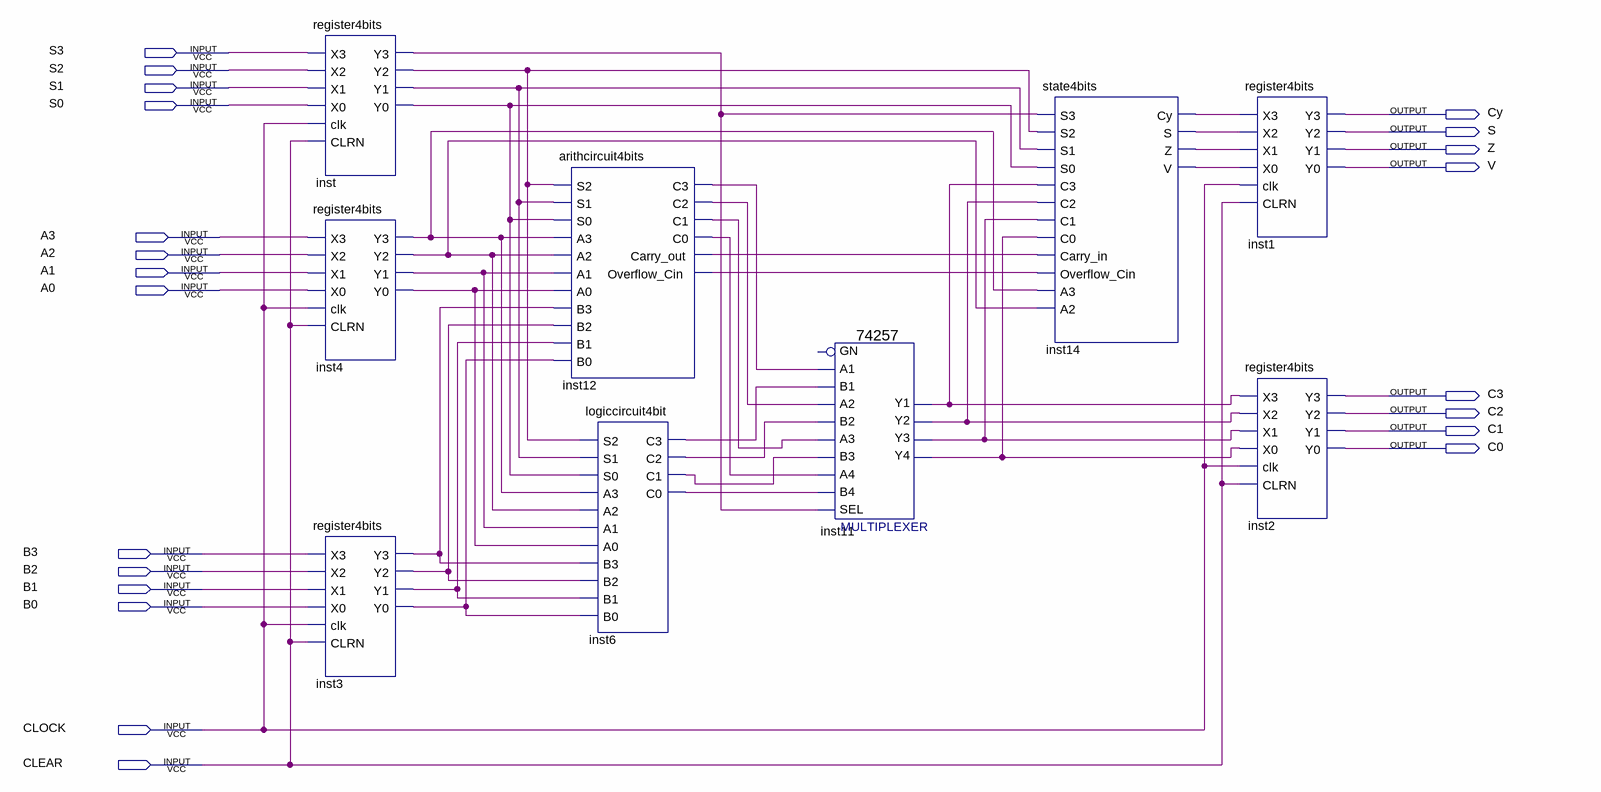
[diagram p0: schematic sheet]
// Quartus schematic lab3top.bdf as structural Verilog: 9 symbols, 22 pins
module lab3top (
  input  S3,
  input  S2,
  input  S1,
  input  S0,
  input  A3,
  input  A2,
  input  A1,
  input  A0,
  input  B3,
  input  B2,
  input  B1,
  input  B0,
  input  CLOCK,
  input  CLEAR,
  output Cy,
  output S,
  output Z,
  output V,
  output C3,
  output C2,
  output C1,
  output C0
);

  wire inst3_y0, inst3_y1, inst3_y2, inst3_y3, inst4_y0, inst4_y1, inst4_y2, inst4_y3, inst6_c0, inst6_c1,
       inst6_c2, inst6_c3, inst11_y1, inst11_y2, inst11_y3, inst11_y4, inst12_c0, inst12_c1, inst12_c2,
       inst12_c3, inst12_carry_out, inst12_overflow_cin, inst14_cy, inst14_s, inst14_v, inst14_z, inst_y0,
       inst_y1, inst_y2, inst_y3;

  register4bits inst (
    .X3(S3), .X2(S2), .X1(S1), .X0(S0), .clk(CLOCK), .CLRN(CLEAR), .Y3(inst_y3), .Y2(inst_y2), .Y1(inst_y1),
    .Y0(inst_y0));
  register4bits inst4 (
    .X3(A3), .X2(A2), .X1(A1), .X0(A0), .clk(CLOCK), .CLRN(CLEAR), .Y3(inst4_y3), .Y2(inst4_y2),
    .Y1(inst4_y1), .Y0(inst4_y0));
  register4bits inst3 (
    .X3(B3), .X2(B2), .X1(B1), .X0(B0), .clk(CLOCK), .CLRN(CLEAR), .Y3(inst3_y3), .Y2(inst3_y2),
    .Y1(inst3_y1), .Y0(inst3_y0));
  arithcircuit4bits inst12 (
    .S2(inst_y2), .S1(inst_y1), .S0(inst_y0), .A3(inst4_y3), .A2(inst4_y2), .A1(inst4_y1), .A0(inst4_y0),
    .B3(inst3_y3), .B2(inst3_y2), .B1(inst3_y1), .B0(inst3_y0), .C3(inst12_c3), .C2(inst12_c2),
    .C1(inst12_c1), .C0(inst12_c0), .Carry_out(inst12_carry_out), .Overflow_Cin(inst12_overflow_cin));
  logiccircuit4bit inst6 (
    .S2(inst_y2), .S1(inst_y1), .S0(inst_y0), .A3(inst4_y3), .A2(inst4_y2), .A1(inst4_y1), .A0(inst4_y0),
    .B3(inst3_y3), .B2(inst3_y2), .B1(inst3_y1), .B0(inst3_y0), .C3(inst6_c3), .C2(inst6_c2), .C1(inst6_c1),
    .C0(inst6_c0));
  \74257  inst11 (
    .B1(inst6_c3), .A1(inst12_c3), .B3(inst6_c1), .A2(inst12_c2), .B2(inst6_c2), .A3(inst12_c1),
    .A4(inst12_c0), .B4(inst6_c0), .SEL(inst_y3), .Y2(inst11_y2), .Y3(inst11_y3), .Y4(inst11_y4),
    .Y1(inst11_y1));  // open: GN
  state4bits inst14 (
    .S3(inst_y3), .S2(inst_y2), .S1(inst_y1), .S0(inst_y0), .C3(inst11_y1), .C2(inst11_y2), .C1(inst11_y3),
    .C0(inst11_y4), .Carry_in(inst12_carry_out), .Overflow_Cin(inst12_overflow_cin), .A3(inst4_y3),
    .A2(inst4_y2), .Cy(inst14_cy), .S(inst14_s), .Z(inst14_z), .V(inst14_v));
  register4bits inst1 (
    .X3(inst14_cy), .X2(inst14_s), .X1(inst14_z), .X0(inst14_v), .clk(CLOCK), .CLRN(CLEAR), .Y3(Cy), .Y2(S),
    .Y1(Z), .Y0(V));
  register4bits inst2 (
    .X3(inst11_y1), .X2(inst11_y2), .X1(inst11_y3), .X0(inst11_y4), .clk(CLOCK), .CLRN(CLEAR), .Y3(C3),
    .Y2(C2), .Y1(C1), .Y0(C0));
endmodule
